# Altium project ECE315-S26.PrjPcb
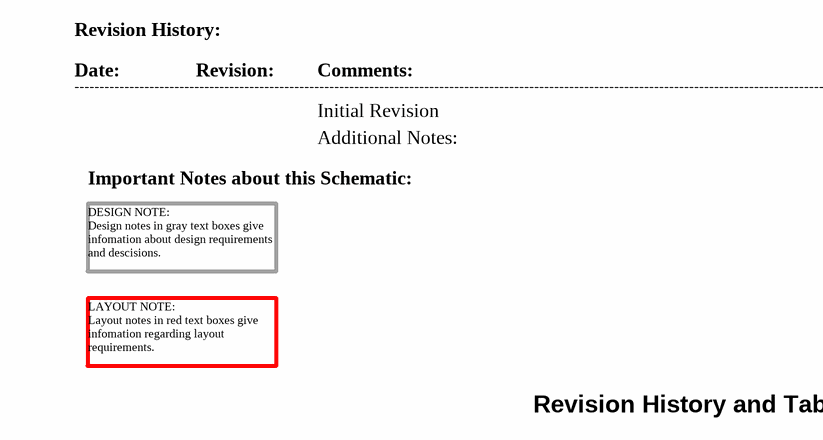
[diagram p0: 01-Revision_History_and_Contents.SchDoc]
ECEProjectName: ECE315 Spring 2026
6 sheets, 47 parts. Net scope: global (net labels, ports and power ports of the same name join across sheets).
Board file: ECE315-S26.PcbDoc
Sheets:
  01-Revision_History_and_Contents.SchDoc
  02_LEDs.SchDoc
  03-MCU.SchDoc
  04-Power_3v3.SchDoc
  05_Buzzer.SchDoc
  06_Reset.SchDoc

## Sheet 01-Revision_History_and_Contents.SchDoc: Revision & History
size A; Revision: A; SheetNumber: 1; SheetTotal: 6

### Notes on the sheet
- Revision History:
- Date:
- ----------------------------------------------------------------------------------------------------------------------------------------------------------------------
- Revision:
- Comments:
- Initial Revision
- Important Notes about this Schematic:
- Additional Notes:
- DESIGN NOTE:
  Design notes in gray text boxes give infomation about design requirements and descisions.
- LAYOUT NOTE:
  Layout notes in red text boxes give infomation regarding layout requirements.
- Revision History and Table of Contents
- Title:
- Size:
- A
- Project
- Rev:
- Sheet:
- of
- College of Engineering
- 1415 Engineering Drive
- Madison, WI 53706

## Sheet 02_LEDs.SchDoc: Serial LEDs
size A; Revision: A; SheetNumber: 2; SheetTotal: 6
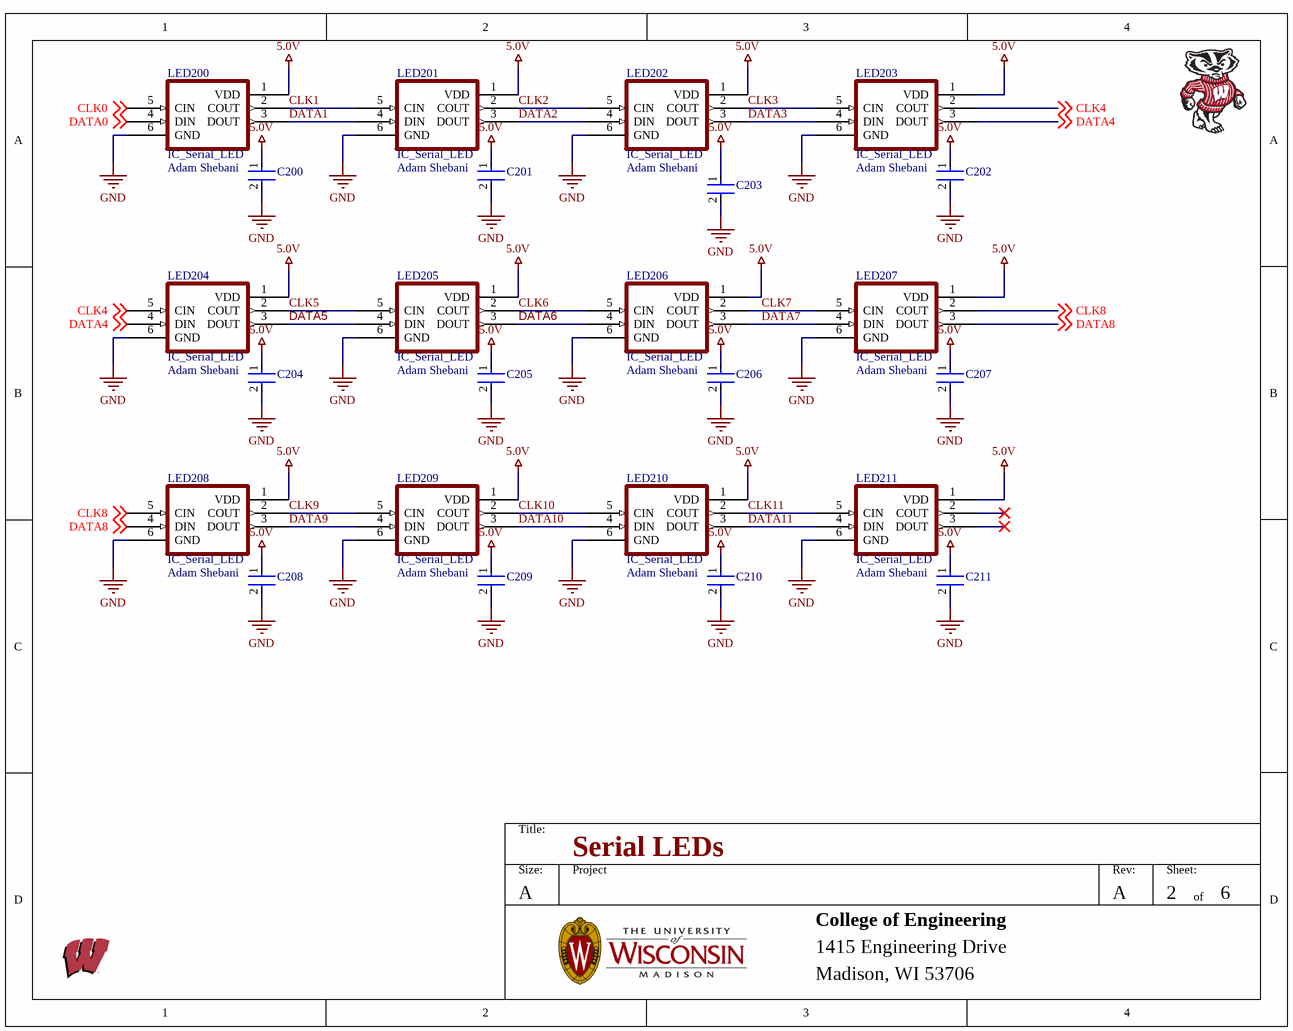
[diagram p1: 02_LEDs.SchDoc]

### Parts
C200  CC1206KRX7R8BB104  [FP-CC1206-1_25-MFG]  (value not drawn)
C201  CC1206KRX7R8BB104  [FP-CC1206-1_25-MFG]  (value not drawn)
C202  CC1206KRX7R8BB104  [FP-CC1206-1_25-MFG]  (value not drawn)
C203  CC1206KRX7R8BB104  [FP-CC1206-1_25-MFG]  (value not drawn)
C204  CC1206KRX7R8BB104  [FP-CC1206-1_25-MFG]  (value not drawn)
C205  CC1206KRX7R8BB104  [FP-CC1206-1_25-MFG]  (value not drawn)
C206  CC1206KRX7R8BB104  [FP-CC1206-1_25-MFG]  (value not drawn)
C207  CC1206KRX7R8BB104  [FP-CC1206-1_25-MFG]  (value not drawn)
C208  CC1206KRX7R8BB104  [FP-CC1206-1_25-MFG]  (value not drawn)
C209  CC1206KRX7R8BB104  [FP-CC1206-1_25-MFG]  (value not drawn)
C210  CC1206KRX7R8BB104  [FP-CC1206-1_25-MFG]  (value not drawn)
C211  CC1206KRX7R8BB104  [FP-CC1206-1_25-MFG]  (value not drawn)
LED200  IC_Serial_LED  Drawn By: Adam Shebani  [IC_Serial_LED]
LED201  IC_Serial_LED  Drawn By: Adam Shebani  [IC_Serial_LED]
LED202  IC_Serial_LED  Drawn By: Adam Shebani  [IC_Serial_LED]
LED203  IC_Serial_LED  Drawn By: Adam Shebani  [IC_Serial_LED]
LED204  IC_Serial_LED  Drawn By: Adam Shebani  [IC_Serial_LED]
LED205  IC_Serial_LED  Drawn By: Adam Shebani  [IC_Serial_LED]
LED206  IC_Serial_LED  Drawn By: Adam Shebani  [IC_Serial_LED]
LED207  IC_Serial_LED  Drawn By: Adam Shebani  [IC_Serial_LED]
LED208  IC_Serial_LED  Drawn By: Adam Shebani  [IC_Serial_LED]
LED209  IC_Serial_LED  Drawn By: Adam Shebani  [IC_Serial_LED]
LED210  IC_Serial_LED  Drawn By: Adam Shebani  [IC_Serial_LED]
LED211  IC_Serial_LED  Drawn By: Adam Shebani  [IC_Serial_LED]

### Nets
5.0V: C200.1 C201.1 C202.1 C203.1 C204.1 C205.1 C206.1 C207.1 C208.1 C209.1 C210.1 C211.1 LED200.1(VDD) LED201.1(VDD) LED202.1(VDD) LED203.1(VDD) LED204.1(VDD) LED205.1(VDD) LED206.1(VDD) LED207.1(VDD) LED208.1(VDD) LED209.1(VDD) LED210.1(VDD) LED211.1(VDD)
GND: C200.2 C201.2 C202.2 C203.2 C204.2 C205.2 C206.2 C207.2 C208.2 C209.2 C210.2 C211.2 LED200.6(GND) LED201.6(GND) LED202.6(GND) LED203.6(GND) LED204.6(GND) LED205.6(GND) LED206.6(GND) LED207.6(GND) LED208.6(GND) LED209.6(GND) LED210.6(GND) LED211.6(GND)
CLK0: LED200.5(CIN) ; off-sheet CLK0
CLK1: LED200.2(COUT) LED201.5(CIN)
CLK2: LED201.2(COUT) LED202.5(CIN)
CLK3: LED202.2(COUT) LED203.5(CIN)
CLK4: LED203.2(COUT) LED204.5(CIN) ; off-sheet CLK4
CLK5: LED204.2(COUT) LED205.5(CIN)
CLK6: LED205.2(COUT) LED206.5(CIN)
CLK7: LED206.2(COUT) LED207.5(CIN)
CLK8: LED207.2(COUT) LED208.5(CIN) ; off-sheet CLK8
CLK9: LED208.2(COUT) LED209.5(CIN)
CLK10: LED209.2(COUT) LED210.5(CIN)
CLK11: LED210.2(COUT) LED211.5(CIN)
DATA0: LED200.4(DIN) ; off-sheet DATA0
DATA1: LED200.3(DOUT) LED201.4(DIN)
DATA2: LED201.3(DOUT) LED202.4(DIN)
DATA3: LED202.3(DOUT) LED203.4(DIN)
DATA4: LED203.3(DOUT) LED204.4(DIN) ; off-sheet DATA4
DATA5: LED204.3(DOUT) LED205.4(DIN)
DATA6: LED205.3(DOUT) LED206.4(DIN)
DATA7: LED206.3(DOUT) LED207.4(DIN)
DATA8: LED207.3(DOUT) LED208.4(DIN) ; off-sheet DATA8
DATA9: LED208.3(DOUT) LED209.4(DIN)
DATA10: LED209.3(DOUT) LED210.4(DIN)
DATA11: LED210.3(DOUT) LED211.4(DIN)

Not connected (* = marked no-connect by the designer): LED211 2(COUT)* 3(DOUT)*

### Notes on the sheet
- Title:
- Size:
- A
- Project
- Rev:
- Sheet:
- of
- College of Engineering
- 1415 Engineering Drive
- Madison, WI 53706

### Library data of the parts
C200-C211 = CMP-1037-04191-3: CAP CER 0.1UF 25V X7R 1206; Manufacturer: Yageo; Value: 100 nF; Material: Ceramic; Tolerance: 0.1; Automotive Grade: NA; Temperature Coefficient: 15%; Description: CC1206 100 nF X7R 10.00%25 V; Category: Cap; Voltage Rating: 25 V; Temperature Range Low: -55°C; Lead Free: Yes; Mouser Description: Multilayer Ceramic Capacitors MLCC - SMD/SMT 100nF 25V X7R 10%; Manufacturer Part Number: CC1206KRX7R8BB104; Octopart: https://octopart.com/cc1206krx7r8bb104-yageo-42334534; Device Class L1: Passive Components; Capacitance: 100 nF; RoHS: TRUE; Automotive: No; Package: CC1206-1.25; Device Class L2: Capacitors; Footprint Url: http://www.yageo.com/exep/pages/download/literatures/UPY-C_GEN_24.pdf; Height: 1.45mm; Temperature: -55°C to +125°C; Temperature Range High: +125°C; ComponentLink2URL: http://www.yageo.com/documents/recent/UPY-NP0X7R_HV_1KV-to-3KV_11.pdf; Temperature Characteristic: X7R; Device Class L3: Ceramic Capacitors; Digikey Description: CAP CER 0.1UF 25V X7R 1206; ComponentLink2Description: Datasheet
LED200-LED211 = IC_Serial_LED: Manufacturer: Harvatek; Manufacturer Part Number: T3A33BRG-H9C0002X1U1930; Supplier: DigiKey; Supplier Part Number: 3147-T3A33BRG-H9C0002X1U1930CT-ND; Category: Optoelectronics; Stock: 6384; Pricing: 1=0.25, 1000=0.23807 (USD)

## Sheet 03-MCU.SchDoc: MCU
size A; Revision: A; SheetNumber: 3; SheetTotal: 6
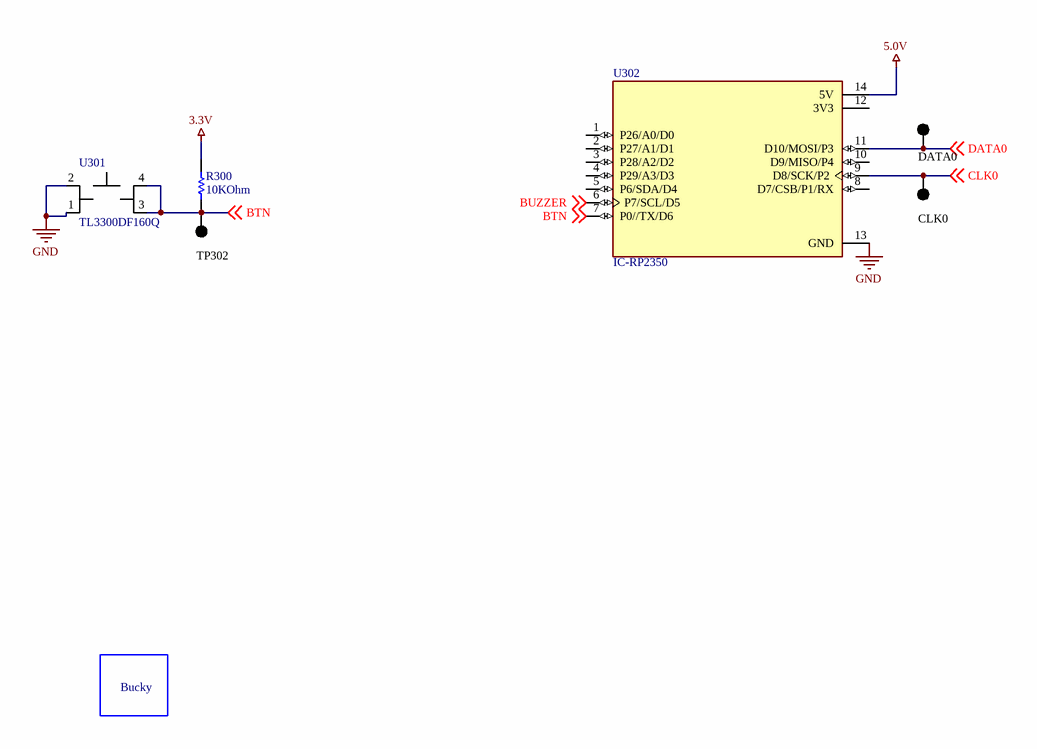
[diagram p2: 03-MCU.SchDoc]

### Parts
(Parts that share a designator on the sheet are numbered #1, #2 ... from top to bottom, then left to right.)
CLK0  5011  [KSTN-5011_V]  (value not drawn)
DATA0  5011  [KSTN-5011_V]  (value not drawn)
R300  Resistance: 10KOhm  [RESC3116X65X40ML10T20]  (hidden comment: RC1206FR-0710KL)
TP302  5011  [KSTN-5011_V]  (value not drawn)
U301  TL3300DF160Q  [TL3300DF160Q]
U302#1  IC-RP2350  [XIAO-RP2350]
U302#2  Bucky  [WalkingBucky]  (value not drawn)  (no BOM)

### Nets
3.3V: R300.2
5.0V: U302#1.14(5V)
GND: U301.1 U301.2 U302#1.13(GND)
BTN: R300.1 TP302.1 U301.3 U301.4(VCCIO) U302#1.7(P0//TX/D6) ; off-sheet BTN
BUZZER: U302#1.6(P7/SCL/D5) ; off-sheet BUZZER
CLK0: CLK0.1 U302#1.9(D8/SCK/P2) ; off-sheet CLK0
DATA0: DATA0.1 U302#1.11(D10/MOSI/P3) ; off-sheet DATA0

Not connected (* = marked no-connect by the designer): U302#1 1(P26/A0/D0) 2(P27/A1/D1) 3(P28/A2/D2) 4(P29/A3/D3) 5(P6/SDA/D4) 8(D7/CSB/P1/RX) 10(D9/MISO/P4) 12(3V3)

### Notes on the sheet
- Title:
- Size:
- A
- Project
- Rev:
- Sheet:
- of
- College of Engineering
- 1415 Engineering Drive
- Madison, WI 53706

### Library data of the parts
CLK0 DATA0 TP302 = CMP-1672-00003-4: Test Point, Black, Through Hole, RoHS, Bulk; Manufacturer: Keystone; ComponentLink2URL: http://www.keyelco.com/product-pdf.cfm?p=1320; Colour: Black; Pins: 1; REACH SVHC: No SVHC; ComponentLink1URL: http://www.keyelco.com/; PackageReference: 5011; Contact Plating: Silver; Package Quantity: 100; Packaging: Bulk; RoHSCompliant: true; Height: 8.12 mm; PackageDescription: 1-Pin Through Hole Device, Dia 3.17 mm; Mount: Through Hole; Mounting Technology: Through Hole; DatasheetVersion: Rev. F, 12/2013; ComponentLink1Description: Manufacturer URL; Contact Material: Bronze; ComponentLink2Description: Datasheet
R300 = CMP-1014-00623-2: Chip Resistor, 10 KOhm, +/- 1%, 0.25 W, -55 to 155 degC, 1206 (3216 Metric), RoHS, Tape and Reel; Manufacturer: Yageo; Voltage Rating: 200V; Temperature Coefficient: 100ppm/degreesC; Power Rating: 250mW; Packaging: TapeandReel; Termination: SMD/SMT; REACH SVHC: Unknown; Tolerance: 1%; Height: 0.55mm; Composition: ThickFilm; Max Operating Temperature: 155degC; Datasheet Version: Rev. 5, 10/2016; Lead Free: LeadFree; Case Code (Metric): 3216; Depth: 1.6mm; Package Quantity: 5000; RoHSCompliant: true; Military Standard: Not; Case/Package: 1206; Case Code (Imperial): 1206; Min Operating Temperature: -55degC; Datasheet URL: http://www.yageo.com/NewPortal/yageodocoutput?fileName=/pdf/R-Chip/PYu-RC_Group_51_RoHS_L_5.pdf; Length: 3.1mm; Manufacturer URL: http://www.yageo.com/; Package Reference: 1206.0; Width: 1.6mm; Package Description: 2-Pin Surface Mount Device, Body 3.1 x 1.6 mm
U301 = TL3300DF160Q: Switch Tactile OFF (ON) SPST Round Button Gull Wing 0.05A 12VDC 1.57N SMD; Manufacturer: E-Switch; Contact Rating @ Voltage: 0.05A @ 12VDC; Outline: 12.00mm x 12.00mm; Circuit: SPST-NO; Switch Travel: 0.35mm; Actuator Type: Standard; Mechanical Life: 200,000 Cycles; Switch Function: Off-Mom; Actuator Height off PCB, from Pins: 4.30mm; Illumination: Non-Illuminated; Operating Force: 160gf; Actuator Orientation: Top Actuated; Current Rating: 50mA; Voltage Rating (DC): 12V; Illumination Voltage (Nominal): -; Mounting Type: Surface Mount; Illumination Type, Color: -; Packaging: Cut Tape (CT); Ingress Protection: -; RoHS: RoHS Compliant; Actuator Material: -; Category: Switches; Manufacturer Part Number: TL3300DF160Q; Operating Temperature: -25°C ~ 70°C; Features: -; Termination Style: Gull Wing; Supplier: Digi-Key; Supplier Part Number: EG4906CT-ND; Supplier 1: Digi-Key; Supplier Part Number 1: EG4906CT-ND; Manufacturer 1: E-Switch; Manufacturer Part Number 1: TL3300DF160Q; Stock 1: 57403; Pricing 1: 1=0.60000, 10=0.57800, 25=0.55680, 100=0.48180, 250=0.43896 (USD); Mount: Surface Mount; Case/Package: SMD/SMT; Contact Plating: Silver; Min Operating Temperature: -25°C; Max Operating Temperature: 70°C; Package Quantity: 1; Termination: Gull Wing; Illumination Type: Non-Illuminated; Throw Configuration: SPST; Series: TL3300; RoHS Compliant: Yes; ComponentLink1URL: https://datasheet.ciiva.com/2900/n301101-2900856.pdf?src-supplier=Digi-Key; ComponentLink1Description: https://datasheet.ciiva.com/2900/n301101-2900856.pdf?src-supplier=Digi-Key; ComponentLink2URL: https://datasheet.ciiva.com/2900/n301101-2900858.pdf?src-supplier=Digi-Key; ComponentLink2Description: https://datasheet.ciiva.com/2900/n301101-2900858.pdf?src-supplier=Digi-Key
U302#1 = IC-RP2350: RP2350 XIAO; MF: Seeed Technology Co., Ltd; MP: 102010428
U302#2 = Bucky: Bucky Badger Image; Manufacturer Part Number: UW Bucky

## Sheet 04-Power_3v3.SchDoc: Power
size A; Revision: A; SheetNumber: 4; SheetTotal: 6
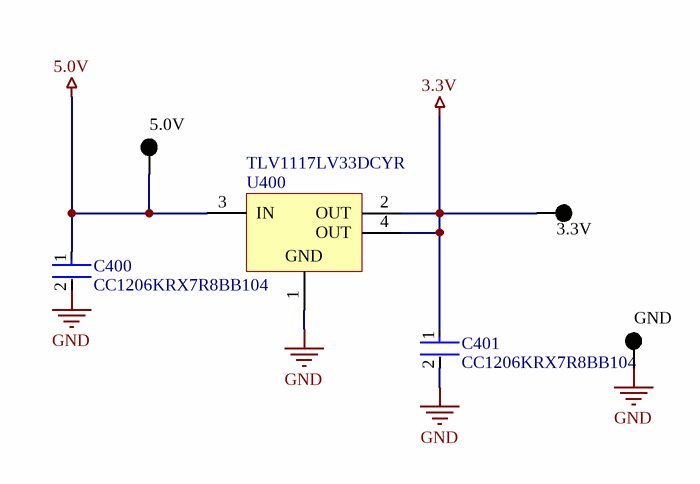
[diagram p3: 04-Power_3v3.SchDoc]

### Parts
3.3V  5011  [KSTN-5011_V]  (value not drawn)
5.0V  5011  [KSTN-5011_V]  (value not drawn)
C400  CC1206KRX7R8BB104  [FP-CC1206-1_25-MFG]
C401  CC1206KRX7R8BB104  [FP-CC1206-1_25-MFG]
GND  5011  [KSTN-5011_V]  (value not drawn)
U400  TLV1117LV33DCYR  [DCY0004A_N]

### Nets
3.3V: 3.3V.1 C401.1 U400.2(OUT) U400.4(OUT)
5.0V: 5.0V.1 C400.1 U400.3(IN)
GND: C400.2 C401.2 GND.1 U400.1(GND)

### Notes on the sheet
- Title:
- Size:
- A
- Project
- Rev:
- Sheet:
- of
- College of Engineering
- 1415 Engineering Drive
- Madison, WI 53706

### Library data of the parts
3.3V 5.0V GND = CMP-1672-00003-4: as CLK0 on sheet 03-MCU; ComponentLink2URL: http://www.keyelco.com/product-pdf.cfm?p=1320; Colour: Black; Pins: 1; REACH SVHC: No SVHC; ComponentLink1URL: http://www.keyelco.com/; PackageReference: 5011; Contact Plating: Silver; Package Quantity: 100; Packaging: Bulk; RoHSCompliant: true; Height: 8.12 mm; PackageDescription: 1-Pin Through Hole Device, Dia 3.17 mm; Mount: Through Hole; Mounting Technology: Through Hole; DatasheetVersion: Rev. F, 12/2013; ComponentLink1Description: Manufacturer URL; Contact Material: Bronze; ComponentLink2Description: Datasheet
C400 C401 = CMP-1037-04191-3: as C200 on sheet 02_LEDs; Category: Cap; Voltage Rating: 25 V; Temperature Range Low: -55°C; Lead Free: Yes; Mouser Description: Multilayer Ceramic Capacitors MLCC - SMD/SMT 100nF 25V X7R 10%; Manufacturer Part Number: CC1206KRX7R8BB104; Octopart: https://octopart.com/cc1206krx7r8bb104-yageo-42334534; Device Class L1: Passive Components; Capacitance: 100 nF; RoHS: TRUE; Automotive: No; Package: CC1206-1.25; Device Class L2: Capacitors; Footprint Url: http://www.yageo.com/exep/pages/download/literatures/UPY-C_GEN_24.pdf; Height: 1.45mm; Temperature: -55°C to +125°C; Temperature Range High: +125°C; ComponentLink2URL: http://www.yageo.com/documents/recent/UPY-NP0X7R_HV_1KV-to-3KV_11.pdf; Temperature Characteristic: X7R; Device Class L3: Ceramic Capacitors; Digikey Description: CAP CER 0.1UF 25V X7R 1206; ComponentLink2Description: Datasheet
U400 = CMP-0395-00503-2: Single Output LDO, 1 A, Fixed 3.3 V Output, 2 to 5.5 V Input, 4-pin SOT-223 (DCY), -40 to 125 degC, Green (RoHS & no Sb/Br); Manufacturer: Texas Instruments; Vout Adj(Min)(V): 3.3; Vdo(Typ)(mV): 1200; Iq(Typ)(mA): 0.05; Accuracy(%): 2; Iout(Max)(A): 1; SubFamily: Single Channel LDO; Vin(Max)(V): 5.5; PackageReference: DCY0004A; PackageDescription: 4-Pin Plastic Small Outline, Body 3.5 x 6.5 mm, Pitch 2.3 mm; Vout Adj(Max)(V): 3.3; Mounting Technology: Surface Mount; ComponentLink2Description: Datasheet; ComponentLink1Description: Manufacturer URL; PartNumber: TLV1117LV33DCYR; ComponentLink3Description: Package Specification; ComponentLink1URL: http://www.ti.com/; ComponentLink2URL: http://www.ti.com/general/docs/lit/getliterature.tsp?genericPartNumber=TLV1117LV33&fileType=pdf; Fixed Output Options(V): 3.3; PackageVersion: 4202506/B; Vin(Min)(V): 2; DatasheetVersion: SBVS160A; Eco-Plan: Green (RoHS & no Sb/Br); ComponentLink3URL: http://www.ti.com/litv/pdf/mpds094a; Code_JEDEC: TO-261

## Sheet 05_Buzzer.SchDoc: Buzzer
size A; Date: 4/25/2017; ApprovedBy: JSK; CheckedBy: JSK; Author: JSK; CompanyName: University of Wisconsin; DrawnBy: JSK; Engineer: JSK; Organization: ECE 315; Address1: College of Engineering; Address2: 1415 Engineering Drive; Address3: Madison, WI 53706; Address4: ECE 315 Fall 2017; Revision: A; SheetNumber: 5; SheetTotal: 6; AssemblyNumber: ECE315-F19; ApprovedDate: 04/02/2019
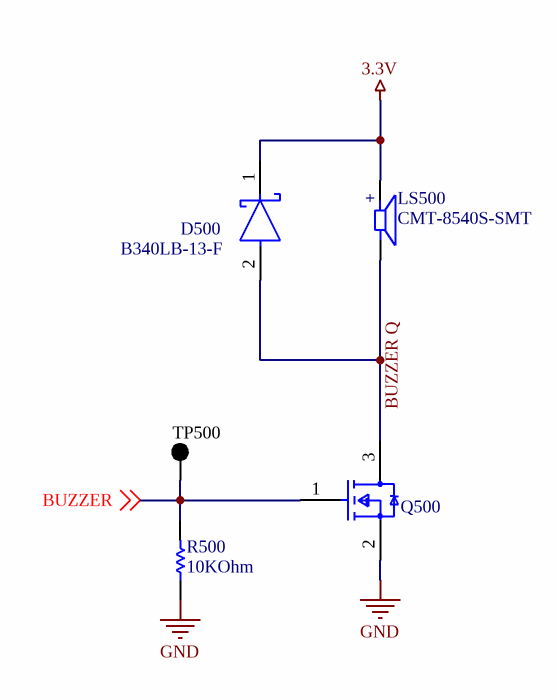
[diagram p4: 05_Buzzer.SchDoc]

### Parts
D500  B340LB-13-F  [FP-SMB-MFG]
LS500  CMT-8540S-SMT  [MBT_Footprint]
Q500  2N7002-7-F  [FP-SOT23-MFG]  (value not drawn)
R500  Resistance: 10KOhm  [RESC3116X65X40ML10T20]  (hidden comment: RC1206FR-0710KL)
TP500  5011  [KSTN-5011_V]  (value not drawn)

### Nets
3.3V: D500.1(C) LS500.P
GND: Q500.2(S) R500.1
BUZZER: Q500.1(G) R500.2 TP500.1 ; off-sheet BUZZER
BUZZER Q: D500.2(A) LS500.N Q500.3(D)

### Notes on the sheet
- Title:
- Size:
- A
- Project
- Rev:
- Sheet:
- of
- College of Engineering
- 1415 Engineering Drive
- Madison, WI 53706
- (in symbol CMT-8540S-SMT) +

### Library data of the parts
D500 = CMP-12790-000022-1: DIODE SCHOTTKY 40V 3A SMB; Manufacturer: Diodes Inc.; Max Surge Forward Current: 70A; Value: 180pF; Peak Reverse Current: 2mA; Standoff Height: 0.05mm; Max Junction Temp: +150°C; Device Class L2: Diodes; Octopart: https://octopart.com/b340lb-13-f-diodes+inc.-325823; Device Class L1: Discrete Semiconductors; Forward Current: 3A; Automotive: No; Manufacturer Part Number: B340LB-13-F; Temperature: -55°C to +150°C; Temperature Range Low: -55°C; Max Repetitive Reverse Voltage: 40V; Device Class L3: Schottky Diodes; RoHS: TRUE; Height: 2.5mm; ComponentLink2URL: https://www.diodes.com/assets/Datasheets/ds30240.pdf; Package: SMB; Digikey Description: DIODE SCHOTTKY 40V 3A SMB; Lead Free: Yes; Category: Diode; Reverse Voltage: 40V; Mouser Description: Schottky Diodes & Rectifiers 40V 3A; ComponentLink2Description: Datasheet; Footprint Url: https://www.diodes.com/assets/Package-Files/SMB.pdf; Temperature Range High: +150°C; Capacitance: 180pF
LS500 = CMT-8540S-SMT: 8.5 mm, 5.0 Vo-p, 100 dB, Surface Mount (SMT), Magnetic Audio Transducer Buzzer; Manufacturer 1: CUI; Manufacturer: Same Sky; MF: CUI Devices; MP: CMT-8540S-SMT-TR; Voltage Rating: 5V; Frequency: 4kHz; Operating Supply Current: 150mA; Shape: Square; CUI_purchase_URL: https://www.cuidevices.com/product/audio/buzzers/audio-transducers/cmt-8540s-smt-tr?utm_source=snapeda.com&utm_medium=referral&utm_campaign=snapedaBOM; SnapEDA_Link: https://www.snapeda.com/parts/CMT-8540S-SMT-TR/CUI%20Devices/view-part/587791/?ref=snap; Availability: Unavailable; Package: CUI Inc.; Value: *; Price: None; Supplier 1: Digi-Key; Supplier Part Number 1: 102-3746-1-ND; Manufacturer Part Number 1: CMT-8540S-SMT-TR; RoHS: Yes; Category: Audio Products; Stock 1: 66147; Pricing 1: 1=3.23000, 10=2.67000, 25=2.46400, 50=2.31400, 100=2.16990, 500=1.91520 (USD); Min Operating Temperature: -20°C; Max Operating Temperature: 70°C; Sensing Method: Magnetic; Lead Free: Lead Free; ComponentLink1URL: https://www.cui.com/product/resource/digikeypdf/cmt-8540s-smt.pdf?src-supplier=Digi-Key; ComponentLink1Description: https://www.cui.com/product/resource/digikeypdf/cmt-8540s-smt.pdf?src-supplier=Digi-Key; Supplier: Arrow Electronics; Supplier Part Number: CMT-8540S-SMT-TR; Manufacturer Part Number: CMT-8540S-SMT-TR; Stock: 8000; Pricing: 1000=1.427 (USD); Height: 4mm; Introduction Date: 2024-09-06; Length: 8.5mm; Lifecycle Status: Production; Mounting Technology: Surface Mount; REACH SVHC: Yes; Schedule B: 8531800040, 8531800040|8531800040, 8531800040|8531800040|8531800040, 8531800040|8531800040|8531800040|8531800040; Width: 8.5mm; ComponentLink2URL: https://datasheet.octopart.com:443/CMT-8540S-SMT-TR-Same-Sky-datasheet-188822742.pdf?src-supplier=Same+Sky; ComponentLink2Description: https://datasheet.octopart.com:443/CMT-8540S-SMT-TR-Same-Sky-datasheet-188822742.pdf?src-supplier=Same+Sky; ComponentLink3URL: https://datasheet.octopart.com:443/CMT-8540S-SMT-TR-Same-Sky-datasheet-181915218.pdf?src-supplier=Same+Sky; ComponentLink3Description: https://datasheet.octopart.com:443/CMT-8540S-SMT-TR-Same-Sky-datasheet-181915218.pdf?src-supplier=Same+Sky; ComponentLink4URL: https://datasheet.octopart.com:443/CMT-8540S-SMT-TR-Same-Sky-datasheet-181915214.pdf?src-supplier=Same+Sky; ComponentLink4Description: https://datasheet.octopart.com:443/CMT-8540S-SMT-TR-Same-Sky-datasheet-181915214.pdf?src-supplier=Same+Sky; ComponentLink5URL: https://datasheet.octopart.com:443/CMT-8540S-SMT-TR-CUI-Devices-datasheet-175924062.pdf?src-supplier=Same+Sky; ComponentLink5Description: https://datasheet.octopart.com:443/CMT-8540S-SMT-TR-CUI-Devices-datasheet-175924062.pdf?src-supplier=Same+Sky; ComponentLink6URL: https://datasheet.octopart.com:443/CMT-8540S-SMT-TR-CUI-Devices-datasheet-137938348.pdf?src-supplier=Same+Sky; ComponentLink6Description: https://datasheet.octopart.com:443/CMT-8540S-SMT-TR-CUI-Devices-datasheet-137938348.pdf?src-supplier=Same+Sky; ComponentLink7URL: https://datasheet.octopart.com:443/CMT-8540S-SMT-TR-Same-Sky-datasheet-190141872.pdf?src-supplier=element14+APAC; ComponentLink7Description: https://datasheet.octopart.com:443/CMT-8540S-SMT-TR-Same-Sky-datasheet-190141872.pdf?src-supplier=element14+APAC; ComponentLink8URL: https://datasheet.octopart.com:443/CMT-8540S-SMT-TR-Same-Sky-datasheet-182879942.pdf?src-supplier=Electro+Sonic; ComponentLink8Description: https://datasheet.octopart.com:443/CMT-8540S-SMT-TR-Same-Sky-datasheet-182879942.pdf?src-supplier=Electro+Sonic; ComponentLink9URL: https://datasheet.octopart.com:443/CMT-8540S-SMT-TR-CUI-Devices-datasheet-175925417.pdf?src-supplier=Master+Electronics; ComponentLink9Description: https://datasheet.octopart.com:443/CMT-8540S-SMT-TR-CUI-Devices-datasheet-175925417.pdf?src-supplier=Master+Electronics; ComponentLink10URL: https://datasheet.octopart.com:443/CMT-8540S-SMT-TR-CUI-Devices-datasheet-140999905.pdf?src-supplier=Master+Electronics; ComponentLink10Description: https://datasheet.octopart.com:443/CMT-8540S-SMT-TR-CUI-Devices-datasheet-140999905.pdf?src-supplier=Master+Electronics; ComponentLink11URL: https://datasheet.octopart.com:443/CMT-8540S-SMT-TR-CUI-Devices-datasheet-103106163.pdf?src-supplier=Master+Electronics; ComponentLink11Description: https://datasheet.octopart.com:443/CMT-8540S-SMT-TR-CUI-Devices-datasheet-103106163.pdf?src-supplier=Master+Electronics; ComponentLink12URL: https://datasheet.octopart.com:443/CMT-8540S-SMT-TR-Same-Sky-datasheet-189104627.pdf?src-supplier=Master+Electronics; ComponentLink12Description: https://datasheet.octopart.com:443/CMT-8540S-SMT-TR-Same-Sky-datasheet-189104627.pdf?src-supplier=Master+Electronics; ComponentLink13URL: https://datasheet.octopart.com:443/CMT-8540S-SMT-TR-Same-Sky-datasheet-188930427.pdf?src-supplier=TME; ComponentLink13Description: https://datasheet.octopart.com:443/CMT-8540S-SMT-TR-Same-Sky-datasheet-188930427.pdf?src-supplier=TME; ComponentLink14URL: https://datasheet.octopart.com:443/CMT-8540S-SMT-TR-Same-Sky-datasheet-182049229.pdf?src-supplier=Future+Electronics; ComponentLink14Description: https://datasheet.octopart.com:443/CMT-8540S-SMT-TR-Same-Sky-datasheet-182049229.pdf?src-supplier=Future+Electronics; ComponentLink15URL: https://datasheet.octopart.com:443/CMT-8540S-SMT-TR-Same-Sky-datasheet-182049228.pdf?src-supplier=Future+Electronics; ComponentLink15Description: https://datasheet.octopart.com:443/CMT-8540S-SMT-TR-Same-Sky-datasheet-182049228.pdf?src-supplier=Future+Electronics; ComponentLink16URL: https://datasheet.octopart.com:443/CMT-8540S-SMT-TR-CUI-Devices-datasheet-175925194.pdf?src-supplier=Future+Electronics; ComponentLink16Description: https://datasheet.octopart.com:443/CMT-8540S-SMT-TR-CUI-Devices-datasheet-175925194.pdf?src-supplier=Future+Electronics; ComponentLink17URL: https://datasheet.octopart.com:443/CMT-8540S-SMT-TR-CUI-Devices-datasheet-140151070.pdf?src-supplier=Future+Electronics; ComponentLink17Description: https://datasheet.octopart.com:443/CMT-8540S-SMT-TR-CUI-Devices-datasheet-140151070.pdf?src-supplier=Future+Electronics; ComponentLink18URL: https://datasheet.octopart.com:443/CMT-8540S-SMT-TR-CUI-Devices-datasheet-175927021.pdf?src-supplier=CUI+Devices+SCT; ComponentLink18Description: https://datasheet.octopart.com:443/CMT-8540S-SMT-TR-CUI-Devices-datasheet-175927021.pdf?src-supplier=CUI+Devices+SCT; ComponentLink19URL: https://datasheet.octopart.com:443/CMT-8540S-SMT-TR-CUI-Devices-datasheet-142348426.pdf?src-supplier=CUI+Devices+SCT; ComponentLink19Description: https://datasheet.octopart.com:443/CMT-8540S-SMT-TR-CUI-Devices-datasheet-142348426.pdf?src-supplier=CUI+Devices+SCT; ComponentLink20URL: https://octopart.com:443/opatz8j6/c1?t=TuT2gNTvJpo_yjRnM7QIcRzfg0x1-xTdTyMxfU2-5t4z1ejkL6PA1jFKuNqkdiWiOSfYO0vvO0p54e5XAzOGaIkHIsr3g49qCyNRee37EbRG1p9GKsoah39OF1Zg1Gz80EG9si1XHmQLLgfWC7KzbsDGlBJlvkgTN80b8dPLQ7E9fPeQcRihUXtqo6YVC6aSoOINB7uzJYK7KUtQWgQHggeFszqcpBhw_xhLRBzDe0ylBNZbwCYqW8v_3NKedSS7Ugfwipe_r_SjQ3v1SR6kXRfBRwb0jh4N92QYN61JqD8Wo72O_FSYd5wFfEYnsPzRXRQyBv1kK3Qx3F7On0xgA1bExSrMbyngCl6rA6Cd&src-supplier=Compliance+Statements; ComponentLink20Description: https://octopart.com:443/opatz8j6/c1?t=TuT2gNTvJpo_yjRnM7QIcRzfg0x1-xTdTyMxfU2-5t4z1ejkL6PA1jFKuNqkdiWiOSfYO0vvO0p54e5XAzOGaIkHIsr3g49qCyNRee37EbRG1p9GKsoah39OF1Zg1Gz80EG9si1XHmQLLgfWC7KzbsDGlBJlvkgTN80b8dPLQ7E9fPeQcRihUXtqo6YVC6aSoOINB7uzJYK7KUtQWgQHggeFszqcpBhw_xhLRBzDe0ylBNZbwCYqW8v_3NKedSS7Ugfwipe_r_SjQ3v1SR6kXRfBRwb0jh4N92QYN61JqD8Wo72O_FSYd5wFfEYnsPzRXRQyBv1kK3Qx3F7On0xgA1bExSrMbyngCl6rA6Cd&src-supplier=Compliance+Statements; ComponentLink21URL: https://octopart.com:443/opatz8j6/c1?t=-w2GoCGQpX4zH2qqt0saqmHF_L2_DJiGJF7AFhdkCk0of-bBcod6T4e_wMdNFwF9tICQRDHBfFEP40JnSh0Ri07gsxTicdoOoQz72w8GHct0sqzxfM9YQ3Ug51fLvc4kpuPXdMJ0lwmmk9g15m3x2rlZXgLpMv25LjTSABL_eYeIFkP--HwPJdHCd4-wvcMMp6cb9lXUq4snrgAEj0Qlf_BK11yy0ExZRztJ5zp5dWebC9gTTPK_Rg_T_Anvyc5OCFxkZP-K8u9fJlPENjcnnWDJ9iY8WcGw0K5sPdYCCUF5QTzXTDnbAkmkb4wzHnWBN85LYTbhtBU1nNVeaP-50RGfX6aIzQ9u2MQT-jDD68Qoug&src-supplier=Compliance+Statements; ComponentLink21Description: https://octopart.com:443/opatz8j6/c1?t=-w2GoCGQpX4zH2qqt0saqmHF_L2_DJiGJF7AFhdkCk0of-bBcod6T4e_wMdNFwF9tICQRDHBfFEP40JnSh0Ri07gsxTicdoOoQz72w8GHct0sqzxfM9YQ3Ug51fLvc4kpuPXdMJ0lwmmk9g15m3x2rlZXgLpMv25LjTSABL_eYeIFkP--HwPJdHCd4-wvcMMp6cb9lXUq4snrgAEj0Qlf_BK11yy0ExZRztJ5zp5dWebC9gTTPK_Rg_T_Anvyc5OCFxkZP-K8u9fJlPENjcnnWDJ9iY8WcGw0K5sPdYCCUF5QTzXTDnbAkmkb4wzHnWBN85LYTbhtBU1nNVeaP-50RGfX6aIzQ9u2MQT-jDD68Qoug&src-supplier=Compliance+Statements; ComponentLink22URL: https://octopart.com:443/opatz8j6/c1?t=DEWJqFhwOSyz_H_REwP9Bf9k-3EkrBXOKtSkjdVkTfQU1-mf8AWbHkGBULwp25c-NbAyZU-d0TOv6aszi-MUttCIYvgOHTczM6OFcH4MT9qHT2EqOHlquyItlLDf08J4rerxoXxwr0TE9QwJbp7kCW8gnIIUvyTQxepN1y8IMW5MP7bhlVkDpt1lOU0K_T8KZ9vKib7VLF1QPBAKGj9ypEcsVqoJUzH46ypG_1kCbAWQxkw9-XDb2CXC4TPpMGUiZX9ecHgV_cRt7HRW6NLn-gmtIJho1C_quWR4T8rckwRYECWGJwTOrudE6RhTXkK1MoqcNtnDLVAdtliNv-h_NT8EekiHfha84-2u-1TD&src-supplier=Compliance+Statements; ComponentLink22Description: https://octopart.com:443/opatz8j6/c1?t=DEWJqFhwOSyz_H_REwP9Bf9k-3EkrBXOKtSkjdVkTfQU1-mf8AWbHkGBULwp25c-NbAyZU-d0TOv6aszi-MUttCIYvgOHTczM6OFcH4MT9qHT2EqOHlquyItlLDf08J4rerxoXxwr0TE9QwJbp7kCW8gnIIUvyTQxepN1y8IMW5MP7bhlVkDpt1lOU0K_T8KZ9vKib7VLF1QPBAKGj9ypEcsVqoJUzH46ypG_1kCbAWQxkw9-XDb2CXC4TPpMGUiZX9ecHgV_cRt7HRW6NLn-gmtIJho1C_quWR4T8rckwRYECWGJwTOrudE6RhTXkK1MoqcNtnDLVAdtliNv-h_NT8EekiHfha84-2u-1TD&src-supplier=Compliance+Statements; ComponentLink23URL: https://octopart.com:443/opatz8j6/c1?t=jWCcU9-kFvbqzH7FA-b8yXQjiAGXcLHMJjku6gw5uolZ388ccMPCd6GO8T7yBdQbJtnCxUYWYjKk6Ufrer_ouEO94Jgx_Izrf5pjDZKgNYEhSmgTnSq9qNsQIZge04OF9OH_pve9O2fLPRIBTKND58KOOTHIUJZETXzsoz4p01ckKyWbhmuYuyEMvH-ZsQdT6wmFz68X4n953Hj-dxnuNxPNndWVNeJ4RO_12vXgbQKdO6i4_fFIKx5FCBxXvG6Qa58jm21I1IS9QSUI55erjCPiFbkVB95jYlYDgLBWhemjfd6pv7MaBNbPlgpKUFh0TUl4FHJHgJ9hFAQ87R40yl1z8QuF1NmEg6gya-npbbEkUg&src-supplier=Compliance+Statements; ComponentLink23Description: https://octopart.com:443/opatz8j6/c1?t=jWCcU9-kFvbqzH7FA-b8yXQjiAGXcLHMJjku6gw5uolZ388ccMPCd6GO8T7yBdQbJtnCxUYWYjKk6Ufrer_ouEO94Jgx_Izrf5pjDZKgNYEhSmgTnSq9qNsQIZge04OF9OH_pve9O2fLPRIBTKND58KOOTHIUJZETXzsoz4p01ckKyWbhmuYuyEMvH-ZsQdT6wmFz68X4n953Hj-dxnuNxPNndWVNeJ4RO_12vXgbQKdO6i4_fFIKx5FCBxXvG6Qa58jm21I1IS9QSUI55erjCPiFbkVB95jYlYDgLBWhemjfd6pv7MaBNbPlgpKUFh0TUl4FHJHgJ9hFAQ87R40yl1z8QuF1NmEg6gya-npbbEkUg&src-supplier=Compliance+Statements; Drawn By: Adam Shebani
Q500 = CMP-2000-04929-2: MOSFET N-CH 60V 115MA SOT23-3; Turn-On Delay Time: 7ns; Turn-Off Delay Time: 11ns; Drain to Source Resistance: 7.5R; Rise Time: 3ns; Drain to Source Breakdown Voltage: 70V; Input Capacitance: 50pF; Number of Elements: 1; Power Dissipation: 540mW; Max Power Dissipation: 300mW; Fall Time: 5.6ns; Gate to Source Voltage (Vgs): 20V; Threshold Voltage: 2.5V; Element Configuration: Single; Termination: SMD/SMT; Weight: 0.000282oz; Radiation Hardening: No; Max Operating Temperature: 150°C; On-State Resistance: 7.5R; Mount: Surface Mount; Current Rating: 115mA; Contact Plating: Tin; Lead Free: Lead Free; Min Operating Temperature: -55°C; Number of Pins: 3; REACH SVHC: No SVHC; Drain to Source Voltage (Vdss): 60V; Width: 1.3mm; Package Quantity: 3000; Length: 2.9mm; Case/Package: SOT-23; Number of Channels: 1; Dual Supply Voltage: 60V; Packaging: Tape and Reel; Height: 1mm; Voltage Rating (DC): 60V; Nominal Vgs: 2.5V; Continuous Drain Current (ID): 115mA; Voltage: 60V; Rds On Max: 7.5R
R500 = CMP-1014-00623-2: as R300 on sheet 03-MCU; Packaging: TapeandReel; Termination: SMD/SMT; REACH SVHC: Unknown; Tolerance: 1%; Height: 0.55mm; Composition: ThickFilm; Max Operating Temperature: 155degC; Datasheet Version: Rev. 5, 10/2016; Lead Free: LeadFree; Case Code (Metric): 3216; Depth: 1.6mm; Package Quantity: 5000; RoHSCompliant: true; Military Standard: Not; Case/Package: 1206; Case Code (Imperial): 1206; Min Operating Temperature: -55degC; Datasheet URL: http://www.yageo.com/NewPortal/yageodocoutput?fileName=/pdf/R-Chip/PYu-RC_Group_51_RoHS_L_5.pdf; Length: 3.1mm; Manufacturer URL: http://www.yageo.com/; Package Reference: 1206.0; Width: 1.6mm; Package Description: 2-Pin Surface Mount Device, Body 3.1 x 1.6 mm
TP500 = CMP-1672-00003-4: as CLK0 on sheet 03-MCU; ComponentLink2URL: http://www.keyelco.com/product-pdf.cfm?p=1320; Colour: Black; Pins: 1; REACH SVHC: No SVHC; ComponentLink1URL: http://www.keyelco.com/; PackageReference: 5011; Contact Plating: Silver; Package Quantity: 100; Packaging: Bulk; RoHSCompliant: true; Height: 8.12 mm; PackageDescription: 1-Pin Through Hole Device, Dia 3.17 mm; Mount: Through Hole; Mounting Technology: Through Hole; DatasheetVersion: Rev. F, 12/2013; ComponentLink1Description: Manufacturer URL; Contact Material: Bronze; ComponentLink2Description: Datasheet

## Sheet 06_Reset.SchDoc: Reset
size A; Revision: A; SheetNumber: 6; SheetTotal: 6
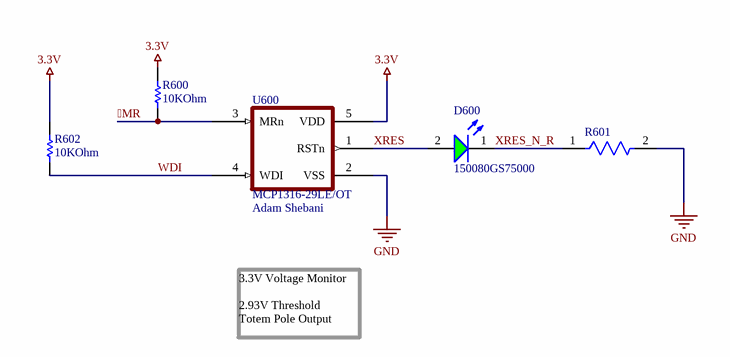
[diagram p5: 06_Reset.SchDoc]

### Parts
D600  150080GS75000  [WL-SMCW_0805_150080xx75000]
R600  Resistance: 10KOhm  [RESC3116X65X40ML10T20]  (hidden comment: RC1206FR-0710KL)
R601  RMCF1206JT330R  [FP-RMCF1206-MFG]  (value not drawn)
R602  Resistance: 10KOhm  [RESC3116X65X40ML10T20]  (hidden comment: RC1206FR-0710KL)
U600  MCP1316-29LE/OT  Drawn By: Adam Shebani  [SOT23-5-MCP-1316T]

### Nets
3.3V: R600.2 R602.2 U600.5(VDD)
GND: R601.2 U600.2(VSS)
MR: R600.1 U600.3(MRn)
WDI: R602.1 U600.4(WDI)
XRES: D600.2(A) U600.1(RSTn)
XRES_N_R: D600.1(K) R601.1

### Notes on the sheet
- 3.3V Voltage Monitor
  2.93V Threshold
  Totem Pole Output
- Title:
- Size:
- A
- Project
- Rev:
- Sheet:
- of
- College of Engineering
- 1415 Engineering Drive
- Madison, WI 53706

### Library data of the parts
D600 = CMP-1426-00007-3: WURTH ELEKTRONIK - 150080GS75000 - LED, Green, SMD, 0805, 30 mA, 3.2 V, 520 nm; Wavelength: 525nm; Forward Current: 100mA; Lens Style: Clear, Rectangular; Max Junction Temperature (Tj): 95°C; Power Dissipation: 105mW; Luminous Intensity: 450mcd; Peak Wavelength: 515nm; Viewing Angle: 140°; Test Current: 20mA; Reverse Voltage: 5V; Forward Voltage: 3.2V; Mount: Surface Mount; Dominant Wavelength: 525nm; REACH SVHC: Unknown; Min Operating Temperature: -40°C; Case Code (Imperial): 0805; Case/Package: 0805; Max Operating Temperature: 85°C; RoHS: Compliant; Length: 2mm; Height: 700µm; Width: 1.25mm; Color: Green; Case Code (Metric): 2012; Packaging: Tape and Reel; Max Reverse Voltage (DC): 5V
R600 R602 = CMP-1014-00623-2: as R300 on sheet 03-MCU; Packaging: TapeandReel; Termination: SMD/SMT; REACH SVHC: Unknown; Tolerance: 1%; Height: 0.55mm; Composition: ThickFilm; Max Operating Temperature: 155degC; Datasheet Version: Rev. 5, 10/2016; Lead Free: LeadFree; Case Code (Metric): 3216; Depth: 1.6mm; Package Quantity: 5000; RoHSCompliant: true; Military Standard: Not; Case/Package: 1206; Case Code (Imperial): 1206; Min Operating Temperature: -55degC; Datasheet URL: http://www.yageo.com/NewPortal/yageodocoutput?fileName=/pdf/R-Chip/PYu-RC_Group_51_RoHS_L_5.pdf; Length: 3.1mm; Manufacturer URL: http://www.yageo.com/; Package Reference: 1206.0; Width: 1.6mm; Package Description: 2-Pin Surface Mount Device, Body 3.1 x 1.6 mm
R601 = CMP-26527-003971-1: 330Ω ±5% 0.25W 1206 Thick Film Chip Resistor AEC-Q200 compliant; Power Rating: 250mW; Resistance: 330R; Temperature Coefficient: 200ppm/°C; Height: 0.028inch; Series: RMCF; Size Code: 1206; Case/Package: 1206; Features: Automotive AEC-Q200; Max Power Dissipation: 250mW; Depth: 1.6mm; Length: 3.2mm; Min Operating Temperature: -55°C; Military Standard: Not; Case Code (Metric): 3216; Radiation Hardening: No; Number of Terminations: 2; Resistor Type: Thick Film; Construction: Rectangular; Packaging: Tape and Reel; Lead Free: Lead Free; Case Code (Imperial): 1206; Contact Plating: Tin; Width: 0.063inch; RoHS Compliant: Yes; Mount: Surface Mount; Max Operating Temperature: 155°C; Tolerance: 5%
U600 = MCP1316-29LE/OT: Pwr Sply Func; Voltage Detector, Voltage Supervisor; SOT-23; VS 1 to 5.5V; IS 10uA; Manufacturer: Microchip; Manufacturer Part Number: MCP1316T-29LE/OT; Max Output current: 10mA; Max Power Dissipation: 240mW; Max Reset Threshold Voltage: 2.944V; Max Supply Current: 10µA; Min Reset Threshold Voltage: 2.857V; Min Supply Voltage: 1V; Number of Channels: 1; Quiescent Current: 1µA; Reset: Active Low; Reset Timeout: 140ms; Threshold Voltage: 2.9V; Watchdog Timer: Yes; Supplier: Arrow Electronics; Supplier Part Number: MCP1316T-29LE/OT; RoHS: Compliant; Category: Voltage Supervisors; Stock: 1723; Pricing: 1=0.8561, 10=0.8476, 25=0.6945, 100=0.694, 250=0.6935, 500=0.693, 1000=0.6925 (USD); Projected EOL Date: 2034-11-18; Case/Package: SOT-23; Country of Assembly: Malaysia, Thailand; Country of Fabrication: United States of America; Country of Origin: Malaysia, Thailand; Export Control Classification Number (ECCN) Code: EAR99; Height: 1.2954mm; Harmonized Tariff Schedule (HTS) Code: 8542.39.0060; Introduction Date: 2005-11-18; Length: 3.0988mm; Lifecycle Status: Production; Max Operating Temperature: 125°C; Max Supply Voltage: 5.5V; Min Operating Temperature: -40°C; Mounting Technology: Surface Mount; Nominal Supply Current: 10µA; Number of Elements: 1; Pins: 5; Number of Voltages Monitored: 1; Operating Supply Current: 10µA; Overvoltage Threshold: 2.944V; Packaging: Cut Tape; Power Dissipation: 240mW; Radiation Hardening: No; REACH SVHC: No; Schedule B: 8542390000, 8542390000|8542390000|8542390000|8542390000|8542390000; Termination: SMD/SMT; Type: Simple Reset/Power-On Reset; Undervoltage Threshold: 2.857V; Width: 1.8034mm; ComponentLink1URL: https://datasheet.octopart.com:443/MCP1316T-29LE/OT-Microchip-datasheet-11051608.pdf?src-supplier=Electro+Sonic; ComponentLink1Description: https://datasheet.octopart.com:443/MCP1316T-29LE/OT-Microchip-datasheet-11051608.pdf?src-supplier=Electro+Sonic; ComponentLink2URL: https://datasheet.octopart.com:443/MCP1316T-29LE-OT-Microchip-datasheet-160583330.pdf?src-supplier=Microchip; ComponentLink2Description: https://datasheet.octopart.com:443/MCP1316T-29LE-OT-Microchip-datasheet-160583330.pdf?src-supplier=Microchip; ComponentLink3URL: https://datasheet.octopart.com:443/MCP1316T-29LE/OT-Microchip-datasheet-12520420.pdf?src-supplier=Microchip+SCT; ComponentLink3Description: https://datasheet.octopart.com:443/MCP1316T-29LE/OT-Microchip-datasheet-12520420.pdf?src-supplier=Microchip+SCT; ComponentLink4URL: https://datasheet.octopart.com:443/MCP1316T-29LE/OT-Microchip-datasheet-609017.pdf?src-supplier=Newark; ComponentLink4Description: https://datasheet.octopart.com:443/MCP1316T-29LE/OT-Microchip-datasheet-609017.pdf?src-supplier=Newark; ComponentLink5URL: https://datasheet.octopart.com:443/MCP1316T-29LE/OT-Microchip-datasheet-30575.pdf?src-supplier=Mouser; ComponentLink5Description: https://datasheet.octopart.com:443/MCP1316T-29LE/OT-Microchip-datasheet-30575.pdf?src-supplier=Mouser; ComponentLink6URL: https://datasheet.octopart.com:443/MCP1316T-29LE-OT-Microchip-datasheet-158592061.pdf?src-supplier=SHENGYU+ELECTRONICS; ComponentLink6Description: https://datasheet.octopart.com:443/MCP1316T-29LE-OT-Microchip-datasheet-158592061.pdf?src-supplier=SHENGYU+ELECTRONICS; ComponentLink7URL: https://datasheet.octopart.com:443/MCP1316T-29LE/OT-Microchip-datasheet-9601151.pdf?src-supplier=RS+(Formerly+Allied+Electronics); ComponentLink7Description: https://datasheet.octopart.com:443/MCP1316T-29LE/OT-Microchip-datasheet-9601151.pdf?src-supplier=RS+(Formerly+Allied+Electronics); ComponentLink8URL: http://sigma.octopart.com:80/188449423/materials_sheet/Microchip-MCP1316T-29LE-OT.pdf?src-supplier=Compliance+Statements; ComponentLink8Description: http://sigma.octopart.com:80/188449423/materials_sheet/Microchip-MCP1316T-29LE-OT.pdf?src-supplier=Compliance+Statements; ComponentLink9URL: http://sigma.octopart.com:80/rohs_statement/Microchip-company-71.pdf?src-supplier=Compliance+Statements; ComponentLink9Description: http://sigma.octopart.com:80/rohs_statement/Microchip-company-71.pdf?src-supplier=Compliance+Statements; ComponentLink10URL: http://sigma.octopart.com:80/reach_statement/Microchip-company-70.pdf?src-supplier=Compliance+Statements; ComponentLink10Description: http://sigma.octopart.com:80/reach_statement/Microchip-company-70.pdf?src-supplier=Compliance+Statements; ComponentLink11URL: http://sigma.octopart.com:80/conflict_mineral_statement/Microchip-company-69.pdf?src-supplier=Compliance+Statements; ComponentLink11Description: http://sigma.octopart.com:80/conflict_mineral_statement/Microchip-company-69.pdf?src-supplier=Compliance+Statements; ComponentLink12URL: http://sigma.octopart.com:80/conflict_mineral_statement/Microchip-company-68.pdf?src-supplier=Compliance+Statements; ComponentLink12Description: http://sigma.octopart.com:80/conflict_mineral_statement/Microchip-company-68.pdf?src-supplier=Compliance+Statements

## Nets that join several sheets
3.3V: 03-MCU (R300.2), 04-Power_3v3 (3.3V.1 C401.1 U400.2 U400.4), 05_Buzzer (D500.1 LS500.P), 06_Reset (R600.2 R602.2 U600.5)
5.0V: 02_LEDs (24 pins), 03-MCU (U302#1.14), 04-Power_3v3 (5.0V.1 C400.1 U400.3)
GND: 02_LEDs (24 pins), 03-MCU (U301.1 U301.2 U302#1.13), 04-Power_3v3 (C400.2 C401.2 GND.1 U400.1), 05_Buzzer (Q500.2 R500.1), 06_Reset (R601.2 U600.2)
BUZZER: 03-MCU (U302#1.6), 05_Buzzer (Q500.1 R500.2 TP500.1)
CLK0: 02_LEDs (LED200.5), 03-MCU (CLK0.1 U302#1.9)
DATA0: 02_LEDs (LED200.4), 03-MCU (DATA0.1 U302#1.11)